# EAGLE design usb_Serial_module_ch340g (EAGLE 6.5.0)
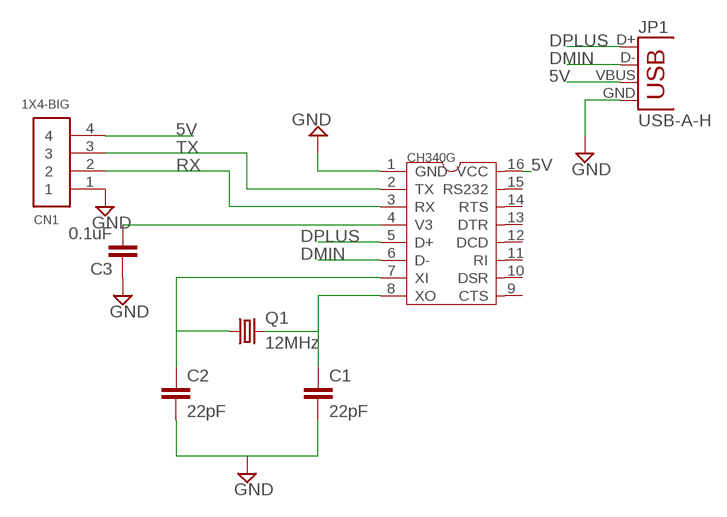
[diagram p0: schematic, sheet 1]

## Parts
C1  22pF  CAP0603-CAP  [0603-CAP]
C2  22pF  CAP0603-CAP  [0603-CAP]
C3  0.1uF  CAP0603-CAP  [0603-CAP]
CH340G  CH340GCH340G  [SOP-16]
CN1  1X4-BIG  [1X04-BIG]
JP1  USB-A-H  [USB-A-H]
Q1  12MHz  CRYSTALHC49U70  [HC49U70]

## Nets
5V: CH340G.16(VCC) CN1.4 JP1.VBUS
DMIN: CH340G.6(D-) JP1.D-
DPLUS: CH340G.5(D+) JP1.D+
GND: C1.2 C2.2 C3.1 CH340G.1(GND) CN1.1 JP1.GND
N$4: C3.2 CH340G.4(V3)
RX: CH340G.3(RX) CN1.2
TX: CH340G.2(TX) CN1.3
XI: C2.1 CH340G.7(XI) Q1.1
XO: C1.1 CH340G.8(XO) Q1.2
Unconnected: CH340G.9(CTS) CH340G.10(DSR) CH340G.11(RI) CH340G.12(DCD) CH340G.13(DTR) CH340G.14(RTS) CH340G.15(RS232)

## Library data of the parts
C1-C3 = SparkFun-Capacitors:CAP: Capacitor Standard 0603 ceramic capacitor, and 0.1" leaded capacitor.
CH340G = digital-ic:CH340G: USB to Serial CH340G
CN1 = adafruit:1X4: 4-pin connector
JP1 = SparkFun-Connectors:USB: USB Connectors USB-B-PTH is fully proven SKU : PRT-00139/CONN-08278 USB-miniB is fully proven SKU : PRT-00587 USB-A-PCB is untested. USB-A-H is throughly reviewed, but untested. Spark Fun Electronics SKU : PRT-00437 USB-B-SMT is throughly reviewed, but untested. Needs silkscreen touching up. USB-A-S has not been used/tested USB-MB-H has not been used/tested USB-MICROB has been used. CONN-09505; PROD_ID: CONN-08367
Q1 = crystal:CRYSTAL: CRYSTAL; OC_FARNELL: unknown; OC_NEWARK: unknown

## Board
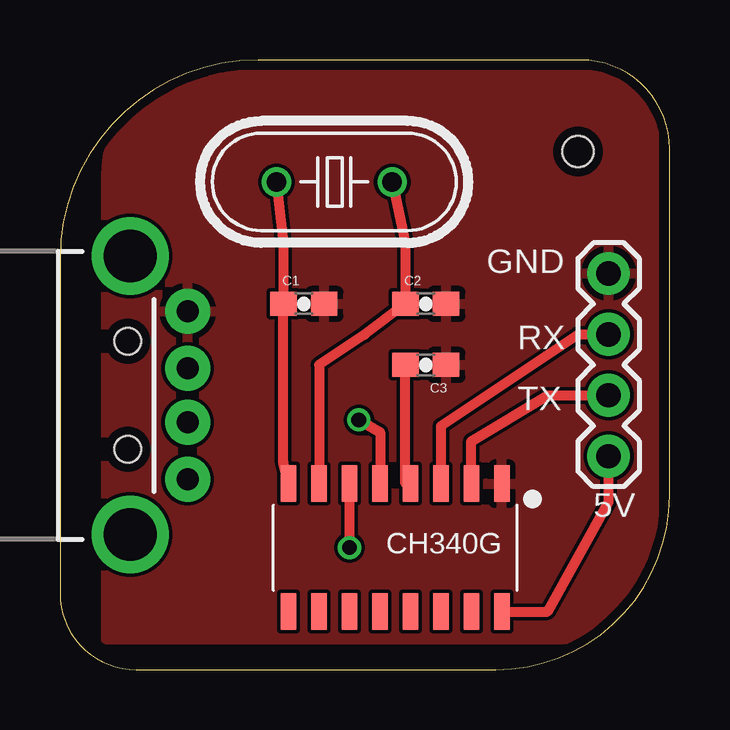
[diagram p1: board, top side]
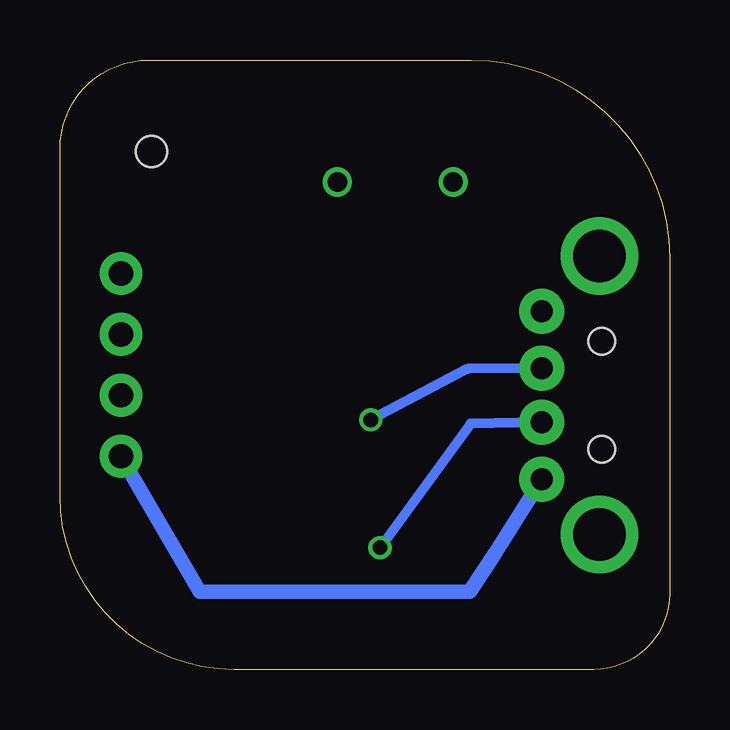
[diagram p2: board, bottom side, seen from below]

Size 25.4 x 25.4 mm. Coordinates in mm from the lower left corner, seen from the top.
Outline: 21.7,25.4 8.26,25.4 arc90 0,17.14 0,3.17 arc90 3.17,0 18.16,0 arc90 25.4,7.24 25.4,21.7 arc90 21.7,25.4
Copper layers (1*16): Top 0.0356mm / dielectric 1.5011mm / Bottom 0.0356mm
Design rules "OSHPARK_LaenPCBOrder": minimum track width 6mil, minimum drill 13mil, track to track 6mil, track to pad 6mil, pad to pad 6mil, via to via 6mil, smd to smd 6mil, copper to edge 15mil, drill to drill 6mil, minimum pad ring 7mil, minimum via ring 7mil, stop-mask expansion 3mil, vias tented up to drill 0mil, thermal gap 10mil
Holes 1.3 mm at 21.59,21.59

### Footprints (pad centres in the part's own frame; a part is rotated, then mirrored left to right if it is on the bottom)
0603-CAP = smd 1.1 x 1: 1 -0.85,0; 2 0.85,0
SOP-16 = smd 0.635 x 1.524: 1 -4.445,-2.667; 2 -3.175,-2.667; 3 -1.905,-2.667; 4 -0.635,-2.667; 5 0.635,-2.667; 6 1.905,-2.667; 7 3.175,-2.667; 8 4.445,-2.667; 9 4.445,2.667; 10 3.175,2.667; 11 1.905,2.667; 12 0.635,2.667; 13 -0.635,2.667; 14 -1.905,2.667; 15 -3.175,2.667; 16 -4.445,2.667
1X04-BIG = drill 1.016 pad 1.778: 1 0,0; 2 2.54,0; 3 5.08,0; 4 7.62,0
USB-A-H = drill 0.914 pad 1.88: D+ 2.4,1.127; D- 2.4,-1.127; GND 2.4,3.5; VBUS 2.4,-3.5 | drill 2.2: GND2 0,-5.8; GND3 0,5.8 | hole 1.1: -0.1,2.25; -0.1,-2.25
HC49U70 = drill 0.813: 1 -2.413,0; 2 2.413,0

### Placement (x,y rotation side)
C1  10.16,15.24 0 top
C2  15.24,15.24 0 top
C3  15.24,12.7 180 top
CH340G  13.97,5.08 180 top
CN1  22.86,16.51 270 top
JP1  2.92,11.43 0 top
Q1  11.43,20.32 180 top

### Tracks (layer width: path | path; a pad name or v marks a point on that pad's centre or on a via)
5V
  Top 0.406: CH340G.16 20.32,2.41 22.86,6.99 CN1.4
  Bottom 0.61: JP1.VBUS 7.29,4.83 8.33,3.25 19.57,3.25 CN1.4
DMIN  (via drill 0.61 pad 0.41)
  Top 0.406: v12.06,5.08 CH340G.6
  Bottom 0.406: JP1.D- 8.29,10.25 v12.06,5.08
DPLUS  (via drill 0.61)
  Top 0.406: v12.45,10.4 13.34,9.89 CH340G.5
  Bottom 0.406: JP1.D+ 8.43,12.53 v12.45,10.4
GND
  pour Top: 24.77,5.06 24.77,23.43 arc90 23.43,24.77 6.1,24.77 arc90 1.91,20.57 1.91,1.27 20.98,1.27 arc90
N$4
  Top 0.406: CH340G.4 14.39,7.75 C3.2
RX
  Top 0.406: CH340G.3 15.88,10.16 21.59,13.97 CN1.2
TX
  Top 0.406: CH340G.2 17.14,9.53 20.32,11.43 CN1.3
XI
  Top 0.406: Q1.1 14.39,17.78 C2.1 12.7,13.97 10.79,12.7 CH340G.7
XO
  Top 0.406: CH340G.8 9.31,8.62 C1.1 9.31,17.78 Q1.2

### Text on the board
tNames: GND | RX | TX | 5V